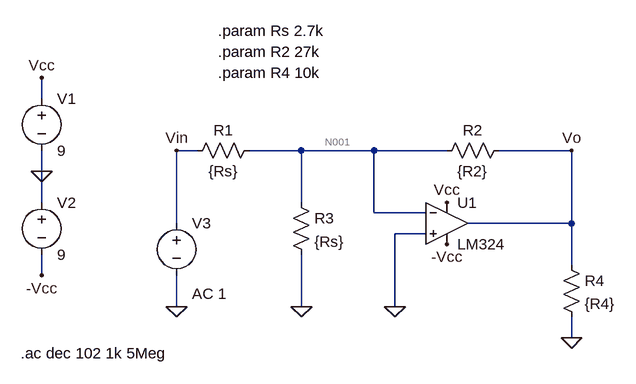
[diagram p0: schematic Inversor_Caso1.asc]
* Inversor_Caso1.asc
* U1: LM324 (symbol sympropio\LM324 not available, pins judged from their places): In+=0 In-=N001 V+=Vcc V-=-Vcc OUT=Vo
V1 Vcc 0 9
V2 0 -Vcc 9
V3 Vin 0 AC 1
R1 N001 Vin {Rs}
R3 N001 0 {Rs}
R2 Vo N001 {R2}
R4 Vo 0 {R4}
.param Rs 2.7k
.param R2 27k
.param R4 10k
.ac dec 102 1k 5Meg
.backanno
.end

* Results of the author's LTspice run, read from the files saved beside the schematic
* Operating Point, zero values left out:
*   V(vo) = -1.245 mV
*   V(-vcc) = -9 V
*   V(vcc) = 9 V
*   V(n001) = -33.64 µV
*   I(R4) = -124.5 nA
*   I(R2) = -44.86 nA
*   I(R3) = -12.46 nA
*   I(R1) = -12.46 nA
*   I(V3) = -12.46 nA
*   I(V2) = -603.8 µA
*   I(V1) = -603.9 µA
*   Ix(u1:1) = -19.92 nA
*   Ix(u1:2) = -19.94 nA
*   Ix(u1:3) = 603.9 µA
*   Ix(u1:4) = -603.8 µA
*   Ix(u1:5) = 169.3 nA
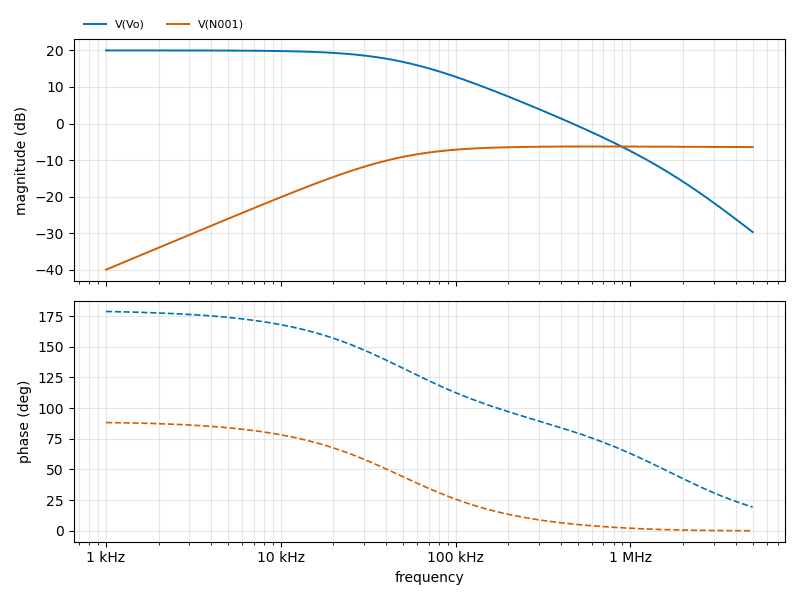
[diagram p1: AC Analysis of Inversor_Caso1.asc, plotted from the saved traces]
* AC Analysis, 1 run:
*   V(Vo): 20.00 dB at 1 kHz, -29.64 dB at 5 MHz, peak 20.00 dB at 1 kHz, 3 dB below the peak at 48.5 kHz
*   V(N001): -39.93 dB at 1 kHz, -6.42 dB at 5 MHz, peak -6.26 dB at 651.2 kHz, 3 dB below the peak at 47.95 kHz